# EAGLE board ab_v10_panel (EAGLE 6.1), part 1 of 2
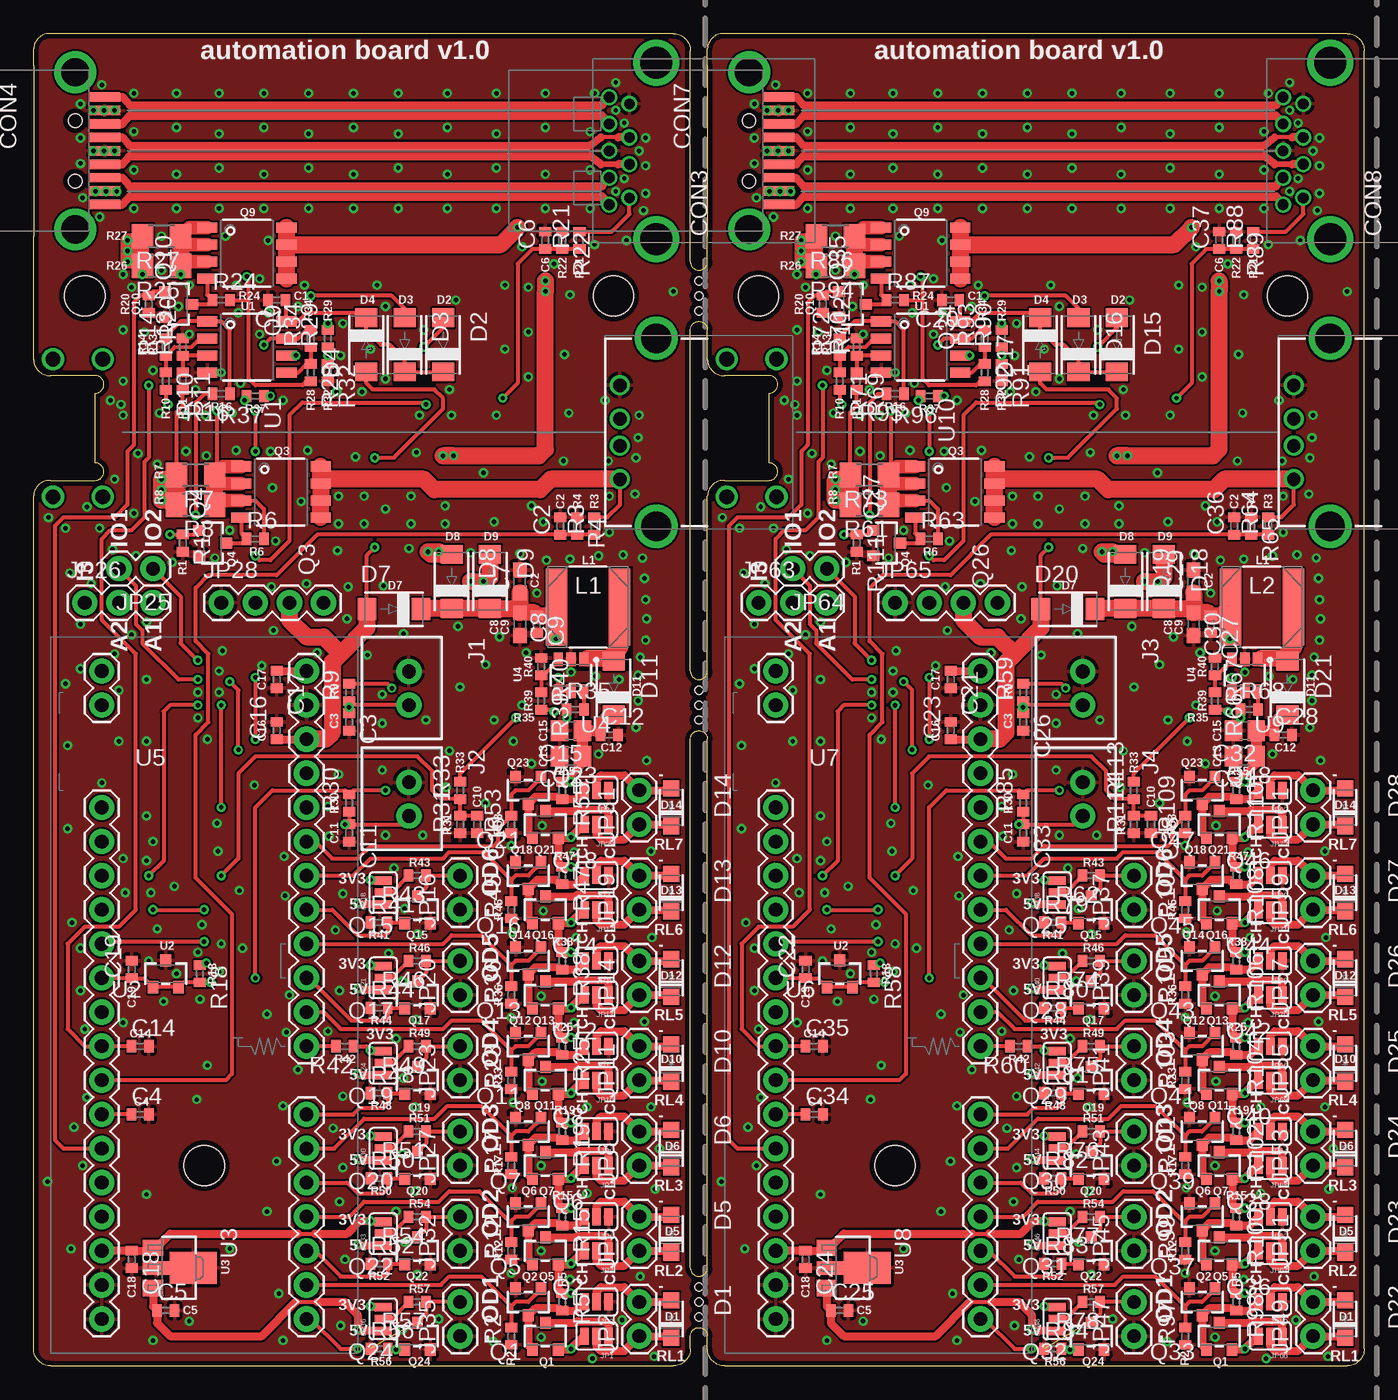
[diagram p5: board, top side]
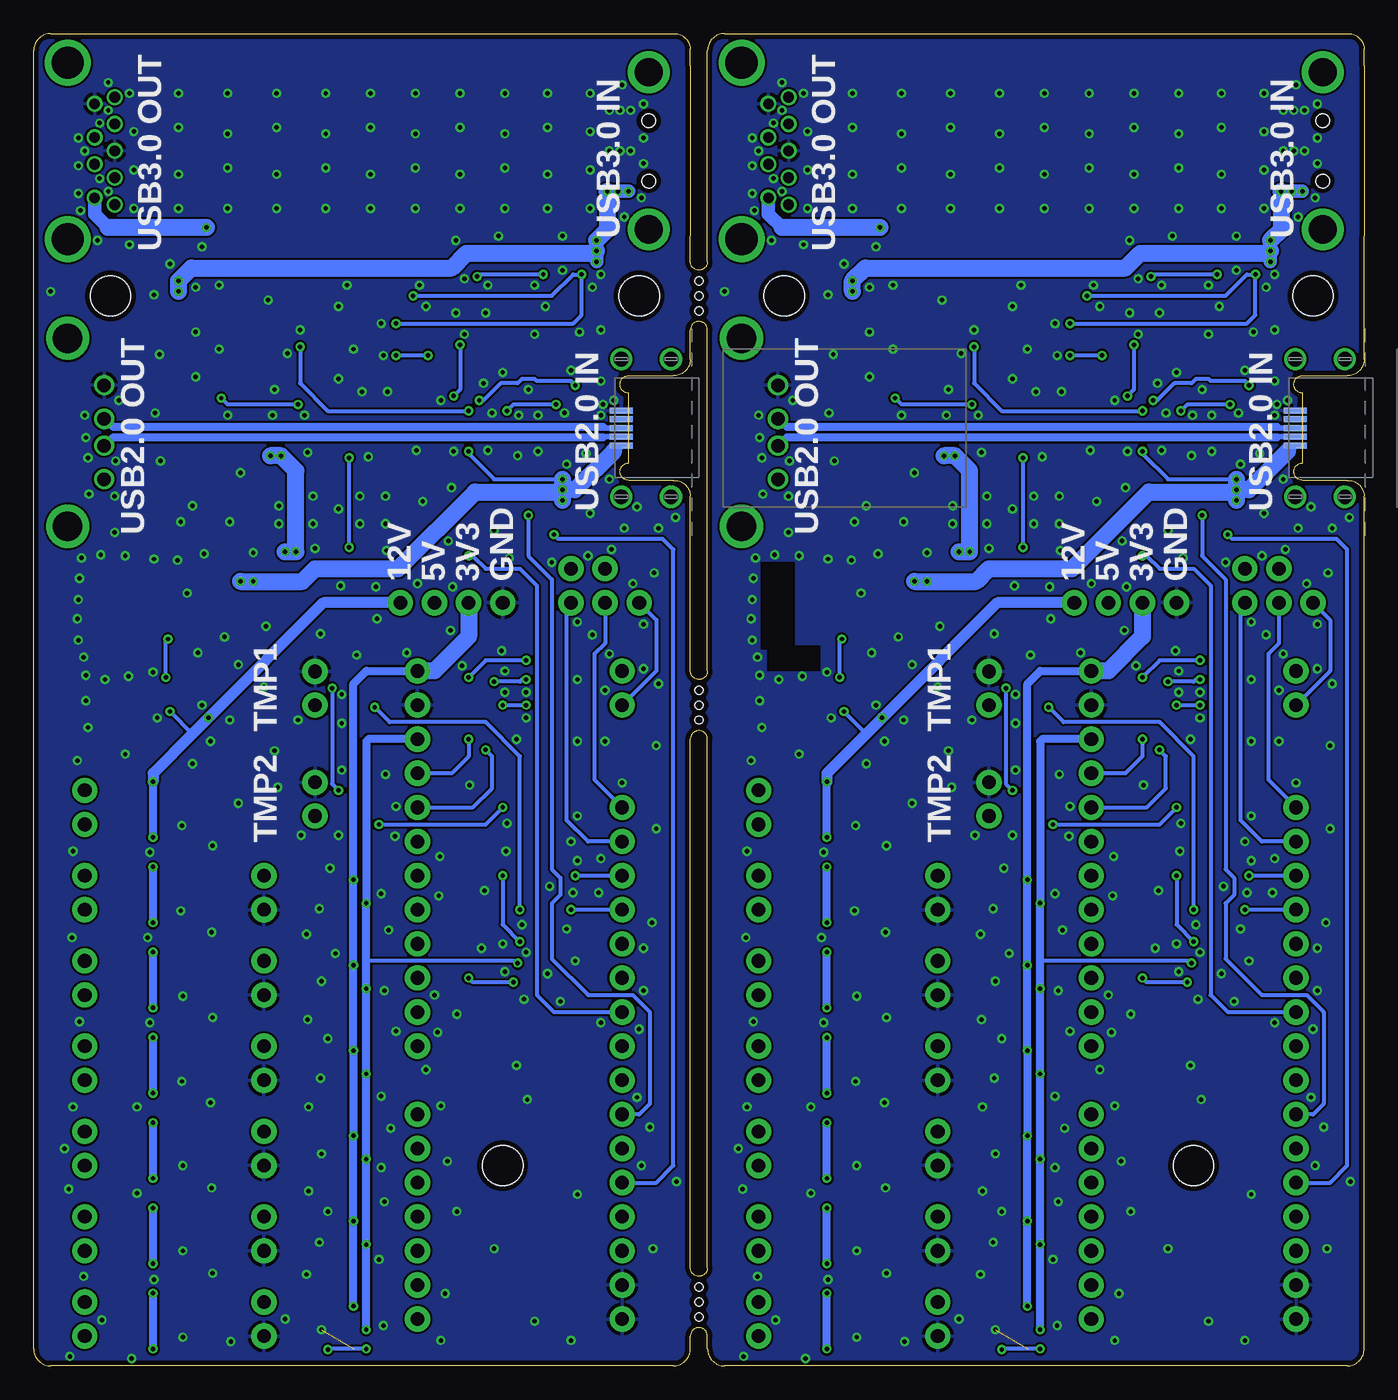
[diagram p6: board, bottom side, seen from below]

Size 99.06 x 99.22 mm. Coordinates in mm from the lower left corner, seen from the top.
Outline: 0,64.77 0,1.27 arc90 1.27,0 47.62,0 arc90 48.9,1.27 48.9,2.22 arc-180 50.16,2.22 50.16,1.27 arc90 51.44,0 97.79,0 arc90 99.06,1.27 99.06,97.95 arc90 97.79,99.22 51.44,99.22 arc90 50.16,98.11 50.16,96.84
Outline: 0,74.93 0,84.14
Outline: 0,96.84 0,98.11 arc-90 1.27,99.22 47.62,99.22 arc-90 48.9,97.95 48.9,82.23 arc180 50.16,82.23 50.16,84.14
Outline: 50.16,64.77 50.16,51.75 arc-180 48.9,51.75 48.9,77.15 arc-180 50.16,77.15 50.16,74.93
Outline: 50.16,7.3 50.16,46.67 arc180 48.9,46.67 48.9,7.3 arc180 50.16,7.3
Copper layers (1*16): Top 0.0356mm / dielectric 1.5011mm / Bottom 0.0356mm
Design rules: minimum track width 6mil, minimum drill 13mil, track to track 6mil, track to pad 6mil, pad to pad 6mil, via to via 6mil, smd to smd 6mil, copper to edge 15mil, drill to drill 6mil, minimum pad ring 7mil, minimum via ring 7mil, stop-mask expansion 4mil, vias tented up to drill 20mil, thermal gap 10mil
Holes 0.6 mm at 49.53,80.8 49.53,78.58 49.53,79.69 49.53,50.32 49.53,48.1 49.53,49.21 49.53,5.87 49.53,3.65 49.53,4.76
Holes 3 mm at 3.81,79.69 43.18,79.69 53.98,79.69 93.34,79.69 12.7,14.92 64.14,14.92
tRestrict: area 39.4,53.5 to 44.6,59.5; area 40.5,51.8 to 44.6,53.5
bRestrict: area 42.4,53.3 to 44.9,59.8; area 40.5,51.8 to 44.5,53.3; area 40.5,53.3 to 42.4,53.7

## Footprints (pad centres in the part's own frame; a part is rotated, then mirrored left to right if it is on the bottom)
C0402 = smd 0.7 x 0.9: 1 -0.65,0; 2 0.65,0
C0603 = smd 1.1 x 1: 1 -0.85,0; 2 0.85,0
C0805 = smd 1.3 x 1.5: 1 -0.85,0; 2 0.85,0
USB_A_C2345 = drill 1: 1-5V -3.5,2.71; 2-D- -1,2.71; 3-D+ 1,2.71; 4-GND 3.5,2.71 | drill 2.2: S1 -7,0; S2 7,0
MICRO_USB-B_C40949 = smd 0.45 x 1.72: 1-VCC -1.3,5.775; 2-D- -0.65,5.775; 3-D+ 0,5.775; 4-ID 0.65,5.775; 5-GND 1.3,5.775 | drill 1.1: S1 -5.125,5.775; S2 -5.125,2.075; S3 5.125,2.075; S4 5.125,5.775
USB3-F-C69073 = drill 0.8: 1-VBUS -3.5,2; 2-D- -1,2; 3-D+ 1,2; 4-GND 3.5,2; 5-SSRX- 4,3.5; 6-SSRX+ 2,3.5; 7-GND 0,3.5; 8-SSTX- -2,3.5; 9-SSTX+ -4,3.5 | drill 2.4: S1 -6.57,0; S2 6.57,0
USB3-M-C68740 = smd 0.7 x 2.3: 1-VBUS 3,2.76; 2-D- 1,2.76; 3-D+ -1,2.76; 4-GND -3,2.76; 5-SSRX- -4,2.76; 6-SSRX+ -2,2.76; 7-GNDD 0,2.76; 8-SSTX- 2,2.76; 9-SSTX+ 4,2.76 | drill 2.1: S1 -5.85,0.56; S2 5.85,0.56 | hole 1: -2.25,0.56; 2.25,0.56
SOD123W = smd 1.2 x 1.2: A -1.4,0; K 1.4,0
SMA = smd 1.4 x 1.64: A -2.015,0; K 2.015,0
B2B-XH-A = drill 1.016 pad 1.88: 1 -2.5,0; 2 0,0
SJ_3 = smd 0.635 x 1.27: 1 -0.889,0; 2 0,0; 3 0.889,0
1X02 = drill 1.016 pad 1.88: 1 0,0; 2 2.54,0
1X03 = drill 1.016 pad 1.88: 1 0,0; 2 2.54,0; 3 5.08,0
1X04 = drill 1.016 pad 1.88: 1 0,0; 2 2.54,0; 3 5.08,0; 4 7.62,0
INDUCTOR_6X6 = smd 1.6 x 5.7: 1 -2.35,0; 2 2.35,0
SOT23 = smd 0.8 x 0.9: 1 0.95,1; 2 -0.95,1; 3 0,-1
8-SOIC = smd 0.75 x 1.5: 1 -1.905,-2.95; 2 -0.635,-2.95; 3 0.635,-2.95; 4 1.905,-2.95; 5 1.905,2.95; 6 0.635,2.95; 7 -0.635,2.95; 8 -1.905,2.95
R0402 = smd 0.7 x 0.9: 1 -0.65,0; 2 0.65,0
R1206 = smd 1.6 x 1.803: 1 -1.422,0; 2 1.422,0
SOT-89 = smd 1.2 x 1.5: 1 -1.5,0; 3 1.5,0 | smd 1 x 2: 2 0,0.25 | smd 2.4 x 3.5: 2@1 0,3
SOT23-6 = smd 0.7 x 1: 1 -0.95,-1.2; 2 0,-1.2; 3 0.95,-1.2; 4 0.95,1.2; 5 0,1.2; 6 -0.95,1.2
STM32_BLUE_PILL_USABLE = drill 1.016 pad 1.88: 3V3 -7.62,-19.05; 3V3_2 7.62,24.13; 5V 7.62,19.05; A0 -7.62,13.97; A1 -7.62,11.43; A2 -7.62,8.89; A3 -7.62,6.35; A4 -7.62,3.81; A5 -7.62,1.27; A6 -7.62,-1.27; A7 -7.62,-3.81; A8 7.62,-13.97; A9 7.62,-11.43; A10 7.62,-8.89; A12 7.62,-3.81; A15 7.62,-1.27; B0 -7.62,-6.35; B1 -7.62,-8.89; B3 7.62,1.27; B4 7.62,3.81; B5 7.62,6.35; B6 7.62,8.89; B7 7.62,11.43; B8 7.62,13.97; B9 7.62,16.51; B10 -7.62,-11.43; B11 -7.62,-13.97; B12 7.62,-24.13; B13 7.62,-21.59; B14 7.62,-19.05; B15 7.62,-16.51; C13 -7.62,21.59; GND -7.62,-24.13; GND2 -7.62,-21.59; GND4 7.62,21.59; RST -7.62,-16.51; VBAT -7.62,24.13

## Placement (x,y rotation side)
C1  1u  [C0402]  18.1,79.38 180 top
C2  22n  [C0402]  39.21,62.55 90 top
C3  1u  [C0402]  23.5,47.94 270 top
C4  10n  [C0402]  7.94,18.73 0 top
C5  1u  [C0402]  9.84,4.13 0 top
C6  22n  [C0402]  38.1,83.82 90 top
C7  10u  [C0603]  36.2,58.42 90 top
C8  10u  [C0603]  36.2,55.24 270 top
C9  100n  [C0402]  37.47,55.24 270 top
C10  22n  [C0402]  33.02,40.32 270 top
C11  1u  [C0402]  23.5,39.69 270 top
C12  100n  [C0402]  42.86,46.99 0 top
C13  10u  [C0805]  40.01,45.4 180 top
C14  10n  [C0402]  7.94,23.81 0 top
C15  10u  [C0805]  40.01,47.31 180 top
C16  1u  [C0402]  18.1,47.31 90 top
C17  1u  [C0402]  18.1,51.12 270 top
C18  1u  [C0402]  7.3,7.94 270 top
C19  4.7u  [C0402]  7.3,29.53 90 top
C20  1u  [C0402]  68.26,79.38 180 top
C21  1u  [C0402]  68.26,51.12 270 top
C22  4.7u  [C0402]  57.47,29.53 90 top
C23  1u  [C0402]  68.26,47.31 90 top
C24  1u  [C0402]  57.47,7.94 270 top
C25  1u  [C0402]  60.01,4.13 0 top
C26  1u  [C0402]  73.66,47.94 270 top
C27  100n  [C0402]  87.63,55.24 270 top
C28  100n  [C0402]  93.03,46.99 0 top
C29  10u  [C0603]  86.36,58.42 90 top
C30  10u  [C0603]  86.36,55.24 270 top
C31  10u  [C0805]  90.17,45.4 180 top
C32  10u  [C0805]  90.17,47.31 180 top
C33  1u  [C0402]  73.66,39.69 270 top
C34  10n  [C0402]  58.1,18.73 0 top
C35  10n  [C0402]  58.1,23.81 0 top
C36  22n  [C0402]  89.38,62.55 90 top
C37  22n  [C0402]  88.27,83.82 90 top
C38  22n  [C0402]  83.19,40.32 270 top
CON1  USB-ABA-C2345  [USB_A_C2345]  46.35,69.53 90 top
CON2  USBC40949  [MICRO_USB-B_C40949]  -0.64,69.85 90 bottom
CON3  USB3F-C69073  [USB3-F-C69073]  46.35,90.49 90 top
CON4  USB3M-C68740  [USB3-M-C68740]  2.54,90.49 270 top
CON5  USBC40949  [MICRO_USB-B_C40949]  49.53,69.85 90 bottom
CON6  USB-ABA-C2345  [USB_A_C2345]  96.52,69.53 90 top
CON7  USB3M-C68740  [USB3-M-C68740]  52.7,90.49 270 top
CON8  USB3F-C69073  [USB3-F-C69073]  96.52,90.49 90 top
D1  B5817W  [SOD123W]  47.47,3.49 270 top
D2  SS14  [SMA]  30.48,76.04 270 top
D3  SS14  [SMA]  27.62,76.04 270 top
D4  SS14  [SMA]  24.77,76.04 90 top
D5  B5817W  [SOD123W]  47.47,9.84 270 top
D6  B5817W  [SOD123W]  47.47,16.19 270 top
D7  SS34  [SMA]  26.83,56.36 0 top
D8  SS34  [SMA]  31.11,58.42 270 top
D9  SS34  [SMA]  33.97,58.42 270 top
D10  B5817W  [SOD123W]  47.47,22.54 270 top
D11  SS34  [SMA]  43.18,50.48 270 top
D12  B5817W  [SOD123W]  47.47,28.89 270 top
D13  B5817W  [SOD123W]  47.47,35.24 270 top
D14  B5817W  [SOD123W]  47.47,41.59 270 top
D15  SS14  [SMA]  80.64,76.04 270 top
D16  SS14  [SMA]  77.79,76.04 270 top
D17  SS14  [SMA]  74.93,76.04 90 top
D18  SS34  [SMA]  84.14,58.42 270 top
D19  SS34  [SMA]  81.28,58.42 270 top
D20  SS34  [SMA]  76.99,56.36 0 top
D21  SS34  [SMA]  93.34,50.48 270 top
D22  B5817W  [SOD123W]  97.63,3.49 270 top
D23  B5817W  [SOD123W]  97.63,9.84 270 top
D24  B5817W  [SOD123W]  97.63,16.19 270 top
D25  B5817W  [SOD123W]  97.63,22.54 270 top
D26  B5817W  [SOD123W]  97.63,28.89 270 top
D27  B5817W  [SOD123W]  97.63,35.24 270 top
D28  B5817W  [SOD123W]  97.63,41.59 270 top
J1  M02XH  [B2B-XH-A]  27.94,49.21 270 top
J2  M02XH  [B2B-XH-A]  27.94,40.96 270 top
J3  M02XH  [B2B-XH-A]  78.11,49.21 270 top
J4  M02XH  [B2B-XH-A]  78.11,40.96 270 top
JP1  JUMPER-3SMD  [SJ_3]  41.91,2.22 180 top
JP2  [1X02]  45.09,2.22 90 top
JP3  JUMPER-3SMD  [SJ_3]  41.91,4.76 180 top
JP4  JUMPER-3SMD  [SJ_3]  41.91,8.57 180 top
JP5  [1X02]  45.09,8.57 90 top
JP6  JUMPER-3SMD  [SJ_3]  41.91,11.11 180 top
JP7  JUMPER-3SMD  [SJ_3]  41.91,14.92 180 top
JP8  [1X02]  45.09,14.92 90 top
JP9  JUMPER-3SMD  [SJ_3]  41.91,17.46 180 top
JP10  JUMPER-3SMD  [SJ_3]  41.91,21.27 180 top
JP11  [1X02]  45.09,21.27 90 top
JP12  JUMPER-3SMD  [SJ_3]  41.91,23.81 180 top
JP13  JUMPER-3SMD  [SJ_3]  41.91,27.62 180 top
JP14  [1X02]  45.09,27.62 90 top
JP15  JUMPER-3SMD  [SJ_3]  41.91,30.16 180 top
JP16  [1X02]  31.75,33.97 90 top
JP17  JUMPER-3SMD  [SJ_3]  41.91,33.97 180 top
JP18  JUMPER-3SMD  [SJ_3]  26.04,35.24 90 top
JP19  [1X02]  45.09,33.97 90 top
JP20  [1X02]  31.75,27.62 90 top
JP21  JUMPER-3SMD  [SJ_3]  26.04,28.89 90 top
JP22  JUMPER-3SMD  [SJ_3]  41.91,36.51 180 top
JP23  [1X02]  31.75,21.27 90 top
JP24  JUMPER-3SMD  [SJ_3]  26.04,22.54 90 top
JP25  [1X02]  8.89,59.37 180 top
JP26  [1X03]  3.81,56.83 0 top
JP27  [1X02]  31.75,14.92 90 top
JP28  [1X04]  13.97,56.83 0 top
JP29  JUMPER-3SMD  [SJ_3]  41.91,40.32 180 top
JP30  JUMPER-3SMD  [SJ_3]  26.04,16.19 90 top
JP31  [1X02]  45.09,40.32 90 top
JP32  [1X02]  31.75,8.57 90 top
JP33  JUMPER-3SMD  [SJ_3]  26.04,9.84 90 top
JP34  JUMPER-3SMD  [SJ_3]  41.91,42.86 180 top
JP35  [1X02]  31.75,2.22 90 top
JP36  JUMPER-3SMD  [SJ_3]  26.04,3.49 90 top
JP37  [1X02]  81.92,33.97 90 top
JP38  JUMPER-3SMD  [SJ_3]  76.2,35.24 90 top
JP39  [1X02]  81.92,27.62 90 top
JP40  JUMPER-3SMD  [SJ_3]  76.2,28.89 90 top
JP41  [1X02]  81.92,21.27 90 top
JP42  JUMPER-3SMD  [SJ_3]  76.2,22.54 90 top
JP43  [1X02]  81.92,14.92 90 top
JP44  JUMPER-3SMD  [SJ_3]  76.2,16.19 90 top
JP45  [1X02]  81.92,8.57 90 top
JP46  JUMPER-3SMD  [SJ_3]  76.2,9.84 90 top
JP47  [1X02]  81.92,2.22 90 top
JP48  JUMPER-3SMD  [SJ_3]  76.2,3.49 90 top
JP49  [1X02]  95.25,2.22 90 top
JP50  JUMPER-3SMD  [SJ_3]  92.08,4.76 180 top
JP51  [1X02]  95.25,8.57 90 top
JP52  JUMPER-3SMD  [SJ_3]  92.08,11.11 180 top
JP53  [1X02]  95.25,14.92 90 top
JP54  JUMPER-3SMD  [SJ_3]  92.08,17.46 180 top
JP55  [1X02]  95.25,21.27 90 top
JP56  JUMPER-3SMD  [SJ_3]  92.08,23.81 180 top
JP57  [1X02]  95.25,27.62 90 top
JP58  JUMPER-3SMD  [SJ_3]  92.08,30.16 180 top
JP59  [1X02]  95.25,33.97 90 top
JP60  JUMPER-3SMD  [SJ_3]  92.08,36.51 180 top
JP61  [1X02]  95.25,40.32 90 top
JP62  JUMPER-3SMD  [SJ_3]  92.08,42.86 180 top
JP63  [1X03]  53.98,56.83 0 top
JP64  [1X02]  59.05,59.37 180 top
JP65  [1X04]  64.14,56.83 0 top
JP66  JUMPER-3SMD  [SJ_3]  92.08,2.22 180 top
JP67  JUMPER-3SMD  [SJ_3]  92.08,8.57 180 top
JP68  JUMPER-3SMD  [SJ_3]  92.08,14.92 180 top
JP69  JUMPER-3SMD  [SJ_3]  92.08,21.27 180 top
JP70  JUMPER-3SMD  [SJ_3]  92.08,27.62 180 top
JP71  JUMPER-3SMD  [SJ_3]  92.08,33.97 180 top
JP72  JUMPER-3SMD  [SJ_3]  92.08,40.32 180 top
L1  4.7u  [INDUCTOR_6X6]  41.27,56.52 0 top
L2  4.7u  [INDUCTOR_6X6]  91.44,56.52 0 top
Q1  AO3401A  [SOT23]  38.1,2.22 180 top
Q2  AO3400A  [SOT23]  36.83,4.76 0 top
Q3  AO4407A  [8-SOIC]  18.41,65.09 270 top
Q4  2N7002  [SOT23]  13.34,61.28 90 top
Q5  AO3401A  [SOT23]  38.1,8.57 180 top
Q6  AO3400A  [SOT23]  36.83,11.11 0 top
Q7  AO3401A  [SOT23]  38.1,14.92 180 top
Q8  AO3400A  [SOT23]  36.83,17.46 0 top
Q9  AO4407A  [8-SOIC]  15.88,82.87 270 top
Q10  2N7002  [SOT23]  10.79,79.06 90 top
Q11  AO3401A  [SOT23]  38.1,21.27 180 top
Q12  AO3400A  [SOT23]  36.83,23.81 0 top
Q13  AO3401A  [SOT23]  38.1,27.62 180 top
Q14  AO3400A  [SOT23]  36.83,30.16 0 top
Q15  2N7002  [SOT23]  28.57,33.97 180 top
Q16  AO3401A  [SOT23]  38.1,33.97 180 top
Q17  2N7002  [SOT23]  28.57,27.62 180 top
Q18  AO3400A  [SOT23]  36.83,36.51 0 top
Q19  2N7002  [SOT23]  28.57,21.27 180 top
Q20  2N7002  [SOT23]  28.57,14.92 180 top
Q21  AO3401A  [SOT23]  38.1,40.32 180 top
Q22  2N7002  [SOT23]  28.57,8.57 180 top
Q23  AO3400A  [SOT23]  36.83,42.86 0 top
Q24  2N7002  [SOT23]  28.57,2.22 180 top
Q25  2N7002  [SOT23]  78.74,33.97 180 top
Q26  AO4407A  [8-SOIC]  68.58,65.09 270 top
Q27  2N7002  [SOT23]  63.5,61.28 90 top
Q28  2N7002  [SOT23]  78.74,27.62 180 top
Q29  2N7002  [SOT23]  78.74,21.27 180 top
Q30  2N7002  [SOT23]  78.74,14.92 180 top
Q31  2N7002  [SOT23]  78.74,8.57 180 top
Q32  2N7002  [SOT23]  78.74,2.22 180 top
Q33  AO3401A  [SOT23]  88.27,2.22 180 top
Q34  AO4407A  [8-SOIC]  66.04,82.87 270 top
Q35  2N7002  [SOT23]  60.96,79.06 90 top
Q36  AO3400A  [SOT23]  87,4.76 0 top
Q37  AO3401A  [SOT23]  88.27,8.57 180 top
Q38  AO3400A  [SOT23]  87,11.11 0 top
Q39  AO3401A  [SOT23]  88.27,14.92 180 top
Q40  AO3400A  [SOT23]  87,17.46 0 top
Q41  AO3401A  [SOT23]  88.27,21.27 180 top
Q42  AO3400A  [SOT23]  87,23.81 0 top
Q43  AO3401A  [SOT23]  88.27,27.62 180 top
Q44  AO3400A  [SOT23]  87,30.16 0 top
Q45  AO3401A  [SOT23]  88.27,33.97 180 top
Q46  AO3400A  [SOT23]  87,36.51 0 top
Q47  AO3401A  [SOT23]  88.27,40.32 180 top
Q48  AO3400A  [SOT23]  87,42.86 0 top
R1  10k  [R0402]  11.11,61.28 270 top
R2  10k  [R0402]  35.56,2.22 90 top
R3  8.2k  [R0402]  41.75,62.55 90 top
R4  10k  [R0402]  40.48,62.55 270 top
R5  10k  [R0402]  39.37,4.76 270 top
R6  10k  [R0402]  16.51,61.59 0 top
R7  100m  [R1206]  12.06,66.36 180 top
R8  100m  [R1206]  12.06,64.14 180 top
R9  10k  [R0402]  23.5,50.16 90 top
R10  1k  [R0402]  9.84,73.34 270 top
R11  1k  [R0402]  11.11,73.34 270 top
R12  10k  [R0402]  35.56,8.57 90 top
R13  20k  [R0402]  11.11,75.88 90 top
R14  20k  [R0402]  9.84,75.88 90 top
R15  10k  [R0402]  39.37,11.11 270 top
R16  10k  [R0402]  13.97,72.39 180 top
R17  10k  [R0402]  35.56,14.92 90 top
R18  120  [R0402]  12.38,29.21 270 top
R19  10k  [R0402]  39.37,17.46 270 top
R20  10k  [R0402]  8.57,79.06 270 top
R21  8.2k  [R0402]  40.64,83.82 90 top
R22  10k  [R0402]  39.37,83.82 270 top
R23  10k  [R0402]  35.56,21.27 90 top
R24  10k  [R0402]  13.97,79.38 0 top
R25  10k  [R0402]  39.37,23.81 270 top
R26  100m  [R1206]  9.53,81.92 180 top
R27  100m  [R1206]  9.53,84.14 180 top
R28  1k  [R0402]  20.64,73.98 270 top
R29  1k  [R0402]  21.91,76.52 90 top
R30  10k  [R0402]  23.5,41.91 90 top
R31  10k  [R0402]  31.75,40.32 90 top
R32  20k  [R0402]  21.91,73.98 270 top
R33  33k  [R0402]  31.75,42.86 90 top
R34  20k  [R0402]  20.64,76.52 90 top
R35  20k  [R0402]  40.32,48.89 0 top
R36  10k  [R0402]  35.56,27.62 90 top
R37  10k  [R0402]  16.51,72.23 180 top
R38  10k  [R0402]  39.37,30.16 270 top
R39  51k  [R0402]  37.78,49.53 270 top
R40  2.7k  [R0402]  37.78,52.07 270 top
R41  10k  [R0402]  25.72,33.02 0 top
R42  1.8k  [R0402]  23.18,23.81 180 top
R43  1k  [R0402]  28.57,36.51 180 top
R44  10k  [R0402]  25.72,26.67 0 top
R45  10k  [R0402]  35.56,33.97 90 top
R46  1k  [R0402]  28.57,30.16 180 top
R47  10k  [R0402]  39.37,36.51 270 top
R48  10k  [R0402]  25.72,20.32 0 top
R49  1k  [R0402]  28.57,23.81 180 top
R50  10k  [R0402]  25.72,13.97 0 top
R51  1k  [R0402]  28.57,17.46 180 top
R52  10k  [R0402]  25.72,7.62 0 top
R53  10k  [R0402]  35.56,40.32 90 top
R54  1k  [R0402]  28.57,11.11 180 top
R55  10k  [R0402]  39.37,42.86 270 top
R56  10k  [R0402]  25.72,1.27 0 top
R57  1k  [R0402]  28.57,4.76 180 top
R58  120  [R0402]  62.55,29.21 270 top
R59  10k  [R0402]  73.66,50.16 90 top
R60  1.8k  [R0402]  73.34,23.81 180 top
R61  100m  [R1206]  62.23,64.14 180 top
R62  1k  [R0402]  78.74,36.51 180 top
R63  10k  [R0402]  66.67,61.59 0 top
R64  8.2k  [R0402]  91.92,62.55 90 top
R65  10k  [R0402]  90.65,62.55 270 top
R66  51k  [R0402]  87.95,49.53 270 top
R67  2.7k  [R0402]  87.95,52.07 270 top
R68  20k  [R0402]  90.49,48.89 0 top
R69  1k  [R0402]  61.28,73.34 270 top
R70  20k  [R0402]  61.28,75.88 90 top
R71  1k  [R0402]  60.01,73.34 270 top
R72  20k  [R0402]  60.01,75.88 90 top
R73  100m  [R1206]  62.23,66.36 180 top
R74  1k  [R0402]  78.74,30.16 180 top
R75  1k  [R0402]  78.74,23.81 180 top
R76  1k  [R0402]  78.74,17.46 180 top
R77  1k  [R0402]  78.74,11.11 180 top
R78  1k  [R0402]  78.74,4.76 180 top
R79  10k  [R0402]  75.88,33.02 0 top
R80  10k  [R0402]  75.88,26.67 0 top
R81  10k  [R0402]  75.88,20.32 0 top
R82  10k  [R0402]  75.88,13.97 0 top
R83  10k  [R0402]  75.88,7.62 0 top
R84  10k  [R0402]  75.88,1.27 0 top
R85  10k  [R0402]  73.66,41.91 90 top
R86  100m  [R1206]  59.69,84.14 180 top
R87  10k  [R0402]  64.14,79.38 0 top
R88  8.2k  [R0402]  90.81,83.82 90 top
R89  10k  [R0402]  89.53,83.82 270 top
R90  1k  [R0402]  72.07,76.52 90 top
R91  20k  [R0402]  72.07,73.98 270 top
R92  1k  [R0402]  70.8,73.98 270 top
R93  20k  [R0402]  70.8,76.52 90 top
R94  100m  [R1206]  59.69,81.92 180 top
R95  10k  [R0402]  64.14,72.39 180 top
R96  10k  [R0402]  66.67,72.23 180 top
R97  10k  [R0402]  85.72,2.22 90 top
R98  10k  [R0402]  89.53,4.76 270 top
R99  10k  [R0402]  85.72,8.57 90 top
R100  10k  [R0402]  89.53,11.11 270 top
R101  10k  [R0402]  85.72,14.92 90 top
R102  10k  [R0402]  89.53,17.46 270 top
R103  10k  [R0402]  85.72,21.27 90 top
R104  10k  [R0402]  89.53,23.81 270 top
R105  10k  [R0402]  85.72,27.62 90 top
R106  10k  [R0402]  89.53,30.16 270 top
R107  10k  [R0402]  85.72,33.97 90 top
R108  10k  [R0402]  89.53,36.51 270 top
R109  10k  [R0402]  85.72,40.32 90 top
R110  10k  [R0402]  89.53,42.86 270 top
R111  10k  [R0402]  61.28,61.28 270 top
R112  10k  [R0402]  58.74,79.06 270 top
R113  33k  [R0402]  81.92,42.86 90 top
R114  10k  [R0402]  81.92,40.32 90 top
U1  MCP6002SOIC  [8-SOIC]  15.88,75.88 270 top
U2  CJ431  [SOT23]  9.84,29.21 180 top
U3  3.3V  [SOT-89]  8.89,7.3 270 top
U4  FP6291  [SOT23-6]  40.01,51.43 180 top
U5  STM32_BLUE_PILL  [STM32_BLUE_PILL_USABLE]  12.7,27.62 0 top
U6  CJ431  [SOT23]  60.01,29.21 180 top
U7  STM32_BLUE_PILL  [STM32_BLUE_PILL_USABLE]  62.87,27.62 0 top
U8  3.3V  [SOT-89]  59.05,7.3 270 top
U9  FP6291  [SOT23-6]  90.17,51.43 180 top
U10  MCP6002SOIC  [8-SOIC]  66.04,75.88 270 top